# EAGLE design Wireless Modular Burn Board (EAGLE 9.6.2)
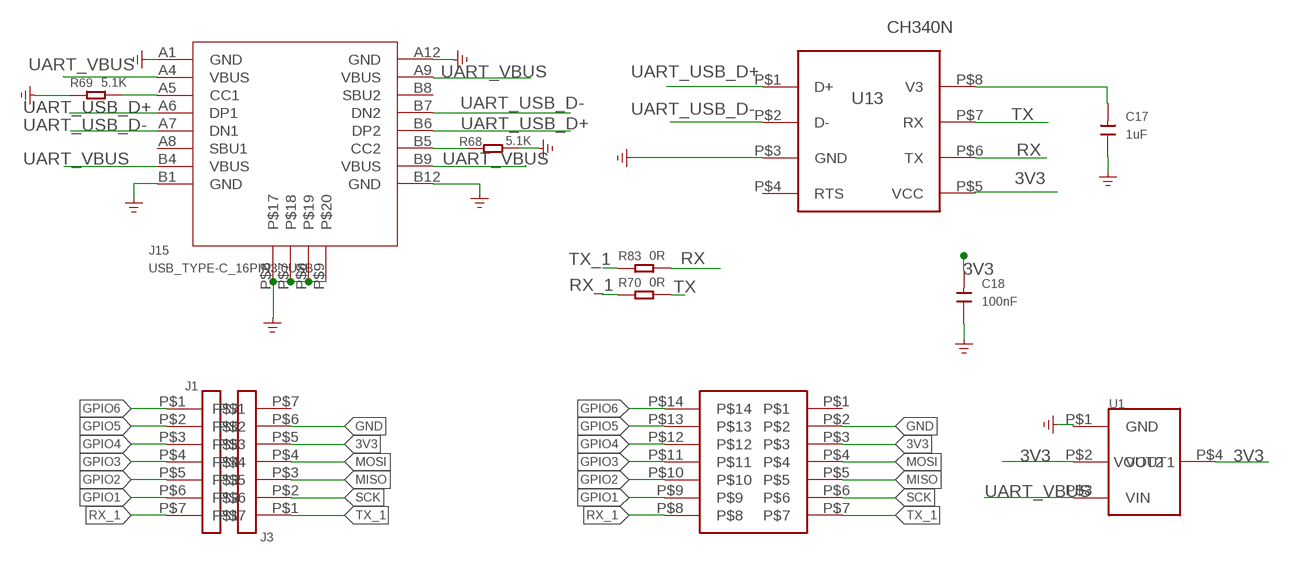
[diagram p0: schematic, sheet 1]

## Parts
C17  1uF  C0603  [0603]
C18  100nF  C0603  [0603]
J1  2.54MM-7P  [2.54MM-7P]
J2  SMT-2.54MM-7P  [SMT-2.54MM-7P]
J3  2.54MM-7P  [2.54MM-7P]
J15  USB_TYPE-C_16PIN3.0USB  [KEVIN_3.0TYPEC-SMD]
R68  5.1K  DISCRETE_R-0603  [DISCRETE_R0603]
R69  5.1K  DISCRETE_R-0603  [DISCRETE_R0603]
R70  0R  DISCRETE_R-0603  [DISCRETE_R0603]
R83  0R  DISCRETE_R-0603  [DISCRETE_R0603]
U1  AMS1117-3V3  [SOT-223]
U13  CH340N  CH340NSOP-8  [SOP8]

## Nets
3V3: C18.2 J2.P$3 J3.P$5 U1.P$2(VOUT1) U1.P$4(VOUT2) U13.P$5(VCC)
GND [GND]: C17.1 C18.1 J2.P$2 J3.P$6 J15.A1(GND) J15.A12(GND) J15.B1(GND) J15.B12(GND) J15.P$6 J15.P$7 J15.P$8 J15.P$9 R68.2 R69.1 U1.P$1(GND) U13.P$3(GND)
GPIO1: J1.P$6 J2.P$9
GPIO2: J1.P$5 J2.P$10
GPIO3: J1.P$4 J2.P$11
GPIO4: J1.P$3 J2.P$12
GPIO5: J1.P$2 J2.P$13
GPIO6: J1.P$1 J2.P$14
MISO: J2.P$5 J3.P$3
MOSI: J2.P$4 J3.P$4
N$5: J15.B5(CC2) R68.1
N$16: J15.A5(CC1) R69.2
N$50: C17.2 U13.P$8(V3)
RX: R83.2 U13.P$6(TX)
RX_1: J1.P$7 J2.P$8 R70.1
SCK: J2.P$6 J3.P$2
TX: R70.2 U13.P$7(RX)
TX_1: J2.P$7 J3.P$1 R83.1
UART_USB_D+ [USB]: J15.A6(DP1) J15.B6(DP2) U13.P$1(D+)
UART_USB_D- [USB]: J15.A7(DN1) J15.B7(DN2) U13.P$2(D-)
UART_VBUS: J15.A4(VBUS) J15.A9(VBUS) J15.B4(VBUS) J15.B9(VBUS) U1.P$3(VIN)
Unconnected: J2.P$1 J3.P$7 J15.A8(SBU1) J15.B8(SBU2) U13.P$4(RTS)

## Library data of the parts
C17 C18 = A_xbj:C0603
J1 J3 = myself:2.54MM-7P
J2 = myself:SMT-2.54MM-7P
J15 = WZ3532R024-ESP32-V0.1-20221226:USB_TYPE-C_16PIN
R68-R70 R83 = Crowtail-_LED-V2.0-20190615-01:DISCRETE_R*
U1 = myself:AMS1117-3V3
U13 = cooper:CH340N

## Net classes
0 default: clearance 0.152 mm
2 GND: width 0.203 mm
4 USB: width 0.203 mm, clearance 0.152 mm

## Board
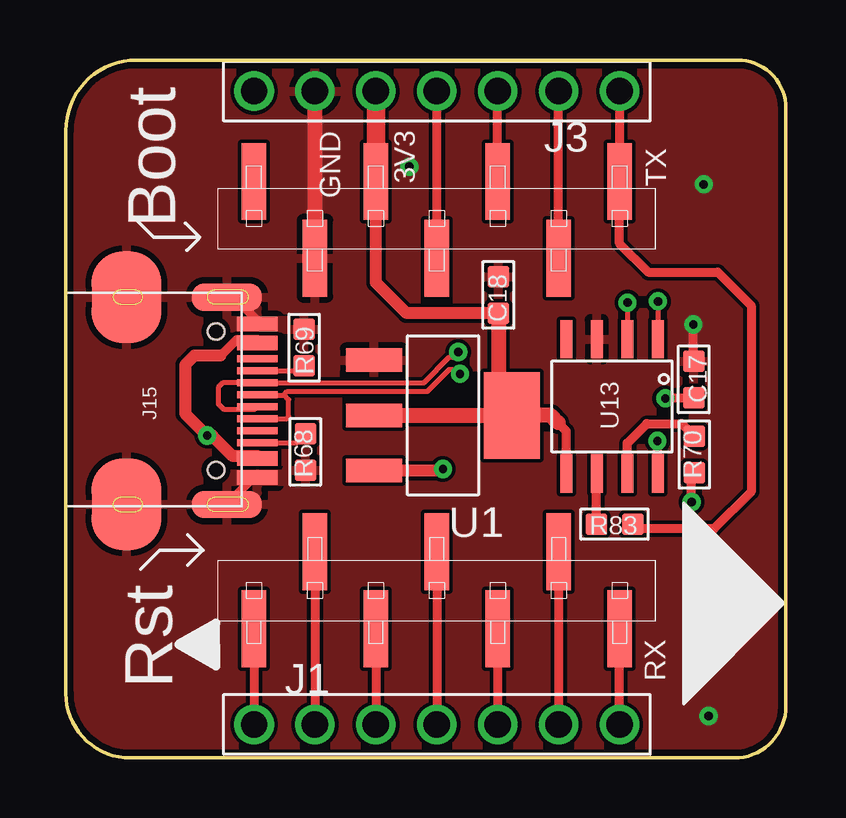
[diagram p1: board, top side]
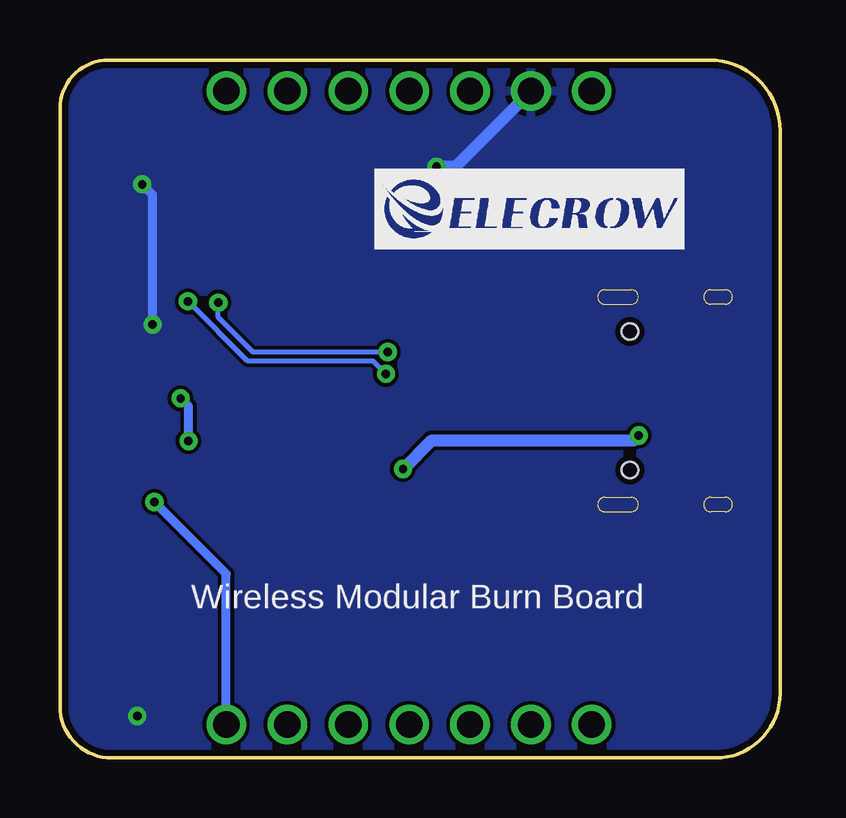
[diagram p2: board, bottom side, seen from below]

Size 30.02 x 29.08 mm. Coordinates in mm from the lower left corner, seen from the top.
Outline: 2.95,29.08 27.99,29.08 arc-90 30.02,27.05 30.02,2.16 arc-90 27.86,0 2.69,0 arc-90 0,2.69 0,26.14 arc-90 2.95,29.08
Copper layers (1*16): Top 0.035mm / dielectric 1.5mm / Bottom 0.035mm
Design rules "default *": minimum track width 6mil, minimum drill 0.35mm, track to track 6mil, track to pad 6mil, pad to pad 6mil, via to via 6mil, smd to smd 6mil, copper to edge 10mil, drill to drill 6mil, minimum pad ring 10mil, minimum via ring 8mil, stop-mask expansion 4mil, vias tented up to drill 30mil, thermal gap 10mil
Milling: area 23.8,-16.3 to 35.2,-4.9

### Footprints (pad centres in the part's own frame; a part is rotated, then mirrored left to right if it is on the bottom)
0603 = smd 0.889 x 0.889: 1 -0.762,0; 2 0.762,0
2.54MM-7P = drill 1.1: P$1 -7.62,0; P$2 -5.08,0; P$3 -2.54,0; P$4 0,0; P$5 2.54,0; P$6 5.08,0; P$7 7.62,0
SMT-2.54MM-7P = smd 3.2 x 1.02: P$1 9.36,6.78; P$2 6.16,4.24; P$3 9.36,1.7; P$4 6.16,-0.84; P$5 9.36,-3.38; P$6 6.16,-5.92; P$7 9.36,-8.46; P$8 -9.27,-8.46; P$9 -6.07,-5.92; P$10 -9.27,-3.38; P$11 -6.07,-0.84; P$12 -9.27,1.7; P$13 -6.07,4.24; P$14 -9.27,6.78
KEVIN_3.0TYPEC-SMD = smd 0.3 x 1.7: A1 -3.35,0.5; A4 -2.55,0.5; A5 -1.25,0.5; A6 -0.25,0.5; A7 0.25,0.5; A8 1.25,0.5; A9 2.55,0.5; A12 3.35,0.5; B1 3.05,0.5; B4 2.25,0.5; B5 1.75,0.5; B6 0.75,0.5; B7 -0.75,0.5; B8 -1.75,0.5; B9 -2.25,0.5; B12 -3.05,0.5 | smd 1.143 x 2.921: P$6 -4.318,-0.762; P$7 4.318,-0.762 | smd 3.81 x 2.921: P$8 -4.318,-4.953; P$9 4.318,-4.953 | hole 0.68: -2.89,-1.22; 2.89,-1.22
DISCRETE_R0603 = smd 0.889 x 0.889: 1 -0.762,0; 2 0.762,0
SOT-223 = smd 2.34 x 0.98: P$1 2.87,-2.3; P$2 2.87,0; P$3 2.87,2.3 | smd 2.34 x 3.6: P$4 -2.87,0
SOP8 = smd 0.5 x 1.6: P$1 -1.905,-2.8; P$2 -0.635,-2.8; P$3 0.635,-2.8; P$4 1.905,-2.8; P$5 1.905,2.8; P$6 0.635,2.8; P$7 -0.635,2.8; P$8 -1.905,2.8

### Placement (x,y rotation side)
C17  26.18,15.77 270 top
C18  18.03,19.3 270 top
J1  15.47,1.4 0 top
J2  14.63,14.66 90 top
J3  15.47,27.79 180 top
J15  7.48,14.88 270 top
R68  9.98,12.76 270 top
R69  9.93,17.1 270 top
R70  26.2,12.65 90 top
R83  22.87,9.74 180 top
U1  15.72,14.27 180 top
U13  22.78,14.65 180 top

### Tracks (layer width: path | path; a pad name or v marks a point on that pad's centre or on a via)
3V3
  Top 0.381: U13.P$5 20.87,13.62 20.52,13.97
  Top 0.508: C18.2 14.21,18.53 12.93,19.81 J2.P$3
  Top 0.635: U1.P$2 U1.P$4 | 20.52,13.97 20.22,14.27 U1.P$4 | C18.2 18.03,14.84 U1.P$4
  Top 0.762: J2.P$3 J3.P$5
GND  (via drill 0.35)
  Top 0.381: C17.1 26.16,16.54 v26.16,18.06 | J15.A1 7.01,19.2 J15.P$6 | J15.B1 J15.P$7
  Top 0.635: J2.P$2 J3.P$6
  Bottom 0.381: v26.16,18.06 26.16,23.47 v26.59,23.9
  Bottom 0.508: J3.P$6 13.54,24.64 v14.33,24.64
  other vias: 26.8,1.75
  pour Top: -1.78,28.96 -1.78,-0.08 31.45,-0.08 31.45,28.96
  pour Bottom: 0.05,29.06 0.05,-0.05 29.95,-0.05 29.95,29.06
GPIO1
  Top 0.381: J1.P$6 J2.P$9
GPIO2
  Top 0.381: J1.P$5 J2.P$10
GPIO3
  Top 0.381: J2.P$11 J1.P$4
GPIO4
  Top 0.381: J2.P$12 J1.P$3
GPIO5
  Top 0.381: J2.P$13 J1.P$2
GPIO6
  Top 0.381: J2.P$14 J1.P$1
MISO
  Top 0.381: J2.P$5 J3.P$3
MOSI
  Top 0.381: J2.P$4 J3.P$4
N$5
  Top 0.203: J15.B5 9.6,13.13 R68.1
N$16
  Top 0.203: J15.A5 9.73,16.13 R69.2
N$50  (via drill 0.35)
  Top 0.381: U13.P$8 24.66,11.87 v24.66,13.21 | v24.99,14.99 25.02,15.01 C17.2
  Bottom 0.381: v24.66,13.21 24.66,14.66 v24.99,14.99
RX
  Top 0.381: R83.2 22.11,11.82 U13.P$6
RX_1  (via drill 0.35)
  Top 0.381: J1.P$7 J2.P$8 | v26.09,10.67 26.09,11.77 R70.1
  Bottom 0.381: J1.P$7 23.09,7.67 v26.09,10.67
SCK
  Top 0.381: J2.P$6 J3.P$2
TX
  Top 0.381: U13.P$7 23.41,13.12 24.22,13.93 25.68,13.93 R70.2
TX_1
  Top 0.381: R83.1 23.83,9.55 27.03,9.55 28.58,11.1 28.58,18.85 27.18,20.24 24.28,20.24 23.09,21.44 J2.P$7 J3.P$1
UART_USB_D+  (via drill 0.35)
  Top 0.203: J15.B6 9.2,14.13 9.3,14.23 9.3,14.93 9.12,15.11 | 9.12,15.11 9.09,15.14 9.23,15.28 15.07,15.28 15.99,16.19 16.24,16.19 v16.43,16 | 9.12,15.11 8.64,15.11 8.61,15.13 J15.A6 | v24.69,19.02 24.69,17.46 U13.P$1
  Bottom 0.203: v16.43,16 16.96,16.54 22.2,16.54 v24.69,19.02
UART_USB_D-  (via drill 0.35)
  Top 0.203: J15.A7 7.89,14.54 6.57,14.54 6.35,14.76 6.35,15.44 6.54,15.63 J15.B7 14.92,15.63 15.98,16.69 16.13,16.69 v16.36,16.91 | v23.42,18.97 23.42,17.46 U13.P$2
  Bottom 0.203: v16.36,16.91 21.97,16.91 23.42,18.36 v23.42,18.97
UART_VBUS  (via drill 0.35)
  Top 0.203: J15.B4 7.98,12.58 | J15.B9 J15.A4
  Top 0.254: 7.98,12.58 J15.A9
  Top 0.381: J15.A4 7.12,17.43 6.45,16.76
  Top 0.508: 6.45,16.76 5.36,16.76 4.98,16.38 4.98,14.35 v5.89,13.44 6.11,13.44 6.96,12.58 7.98,12.58 | v15.72,12.04 15.66,11.97 U1.P$3
  Bottom 0.508: v5.89,13.44 6.1,13.23 14.53,13.23 v15.72,12.04

### Text on the board
tPlace: Boot | GND | 3V3 | TX | Rst | RX
bPlace: Wireless Modular Burn Board
tValues: LED